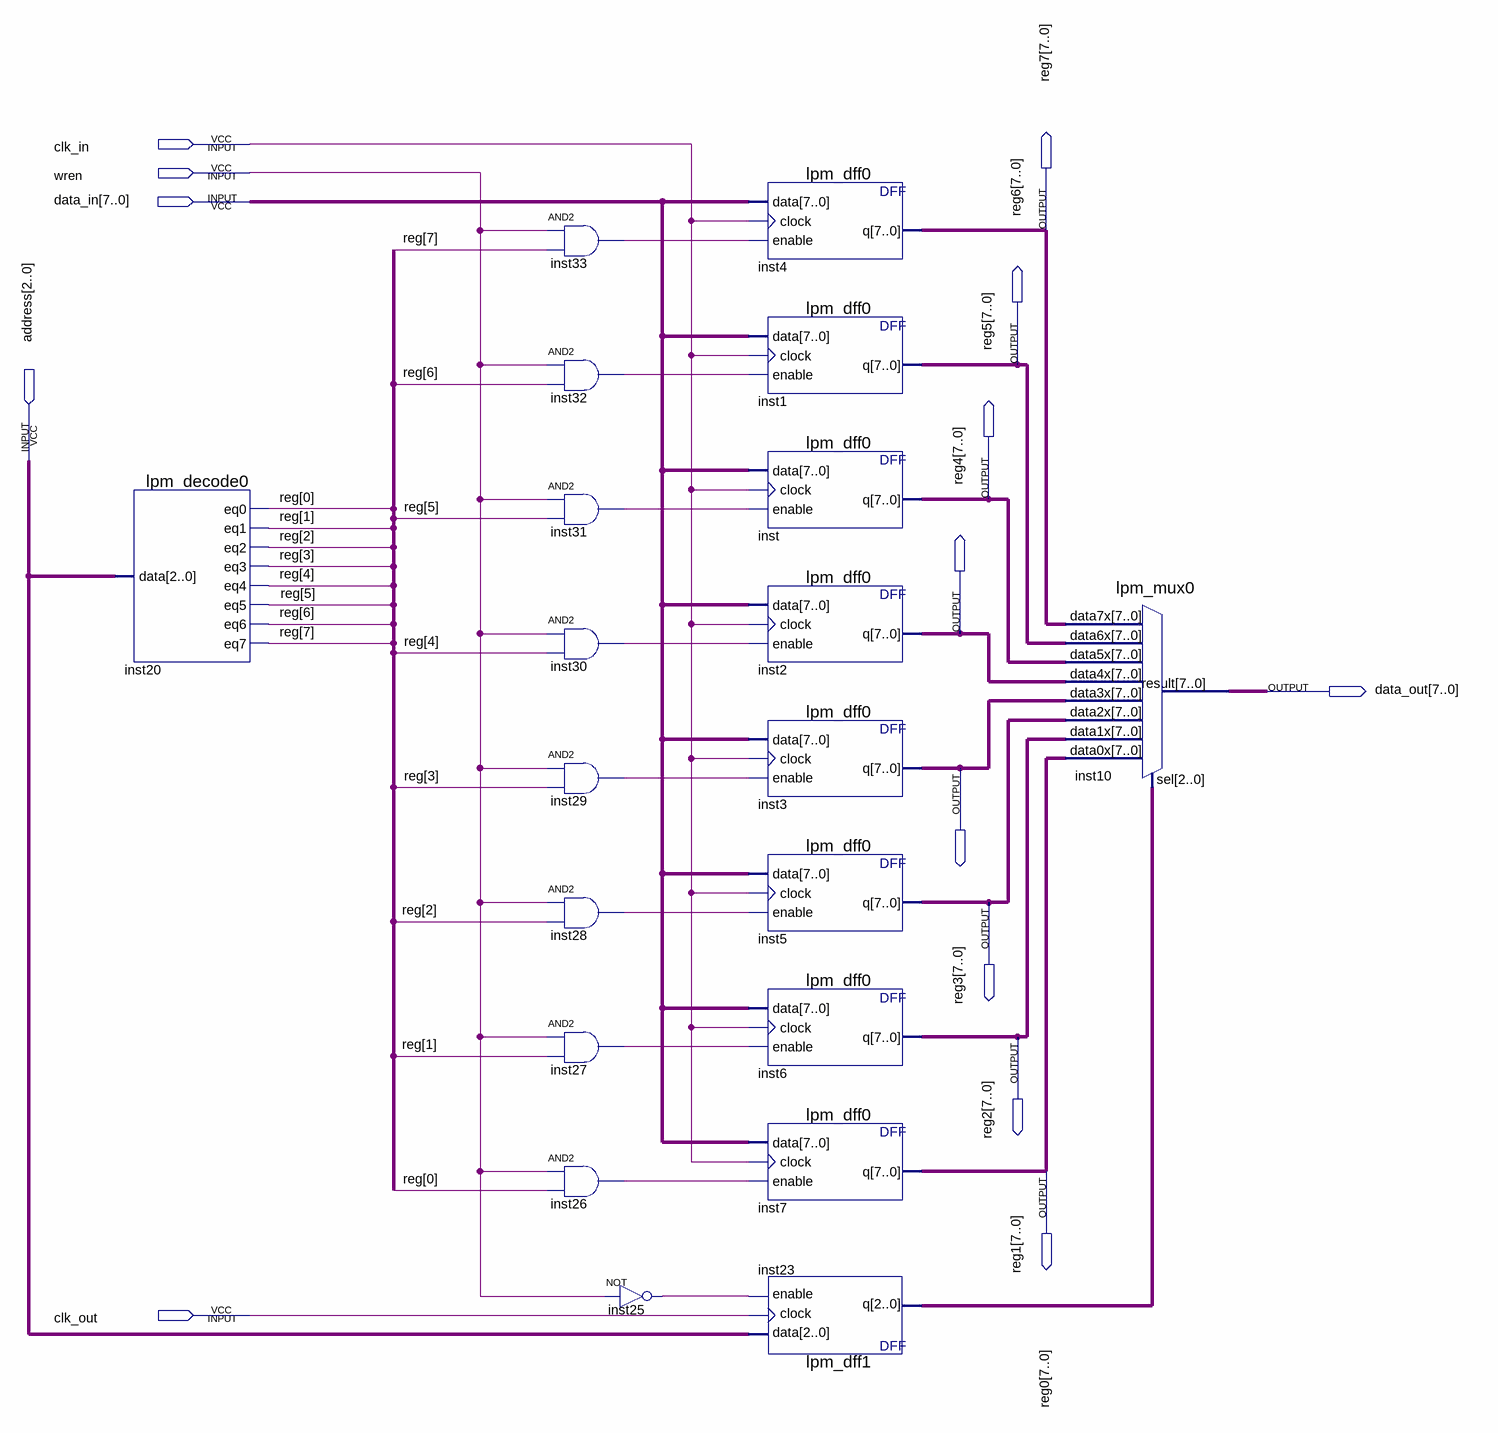
[diagram p0: schematic sheet]
// Quartus schematic GPR.bdf as structural Verilog: 20 symbols, 14 pins
module GPR (
  input  clk_in,
  input  wren,
  input  [7:0] data_in,
  input  [2:0] address,
  input  clk_out,
  output [7:0] reg7,
  output [7:0] reg6,
  output [7:0] reg5,
  output [7:0] reg4,
  output [7:0] data_out,
  output [7:0] reg3,
  output [7:0] reg2,
  output [7:0] reg1,
  output [7:0] reg0
);

  wire inst25_out, inst26_out, inst27_out, inst28_out, inst29_out, inst30_out, inst31_out, inst32_out,
       inst33_out;
  wire [2:0] inst23_q;
  wire [7:0] \reg ;

  lpm_decode0 inst20 (
    .data(address), .eq0(\reg [0]), .eq1(\reg [1]), .eq2(\reg [2]), .eq3(\reg [3]), .eq4(\reg [4]),
    .eq5(\reg [5]), .eq6(\reg [6]), .eq7(\reg [7]));
  and inst33 (inst33_out, wren, \reg [7]);
  and inst32 (inst32_out, wren, \reg [6]);
  and inst31 (inst31_out, wren, \reg [5]);
  and inst30 (inst30_out, wren, \reg [4]);
  and inst29 (inst29_out, wren, \reg [3]);
  and inst28 (inst28_out, wren, \reg [2]);
  and inst27 (inst27_out, wren, \reg [1]);
  and inst26 (inst26_out, wren, \reg [0]);
  not inst25 (inst25_out, wren);
  lpm_dff0 inst4 (.data(data_in), .clock(clk_in), .enable(inst33_out), .q(reg7));
  lpm_dff0 inst1 (.data(data_in), .clock(clk_in), .enable(inst32_out), .q(reg6));
  lpm_dff0 inst (.data(data_in), .clock(clk_in), .enable(inst31_out), .q(reg5));
  lpm_dff0 inst2 (.data(data_in), .clock(clk_in), .enable(inst30_out), .q(reg4));
  lpm_dff0 inst3 (.data(data_in), .clock(clk_in), .enable(inst29_out), .q(reg3));
  lpm_dff0 inst5 (.data(data_in), .clock(clk_in), .enable(inst28_out), .q(reg2));
  lpm_dff0 inst6 (.data(data_in), .clock(clk_in), .enable(inst27_out), .q(reg1));
  lpm_dff0 inst7 (.data(data_in), .clock(clk_in), .enable(inst26_out), .q(reg0));
  lpm_dff1 inst23 (.data(address), .clock(clk_out), .enable(inst25_out), .q(inst23_q));
  lpm_mux0 inst10 (
    .data7x(reg7), .data6x(reg6), .data5x(reg5), .data4x(reg4), .data3x(reg3), .data2x(reg2), .data1x(reg1),
    .data0x(reg0), .sel(inst23_q), .result(data_out));
endmodule
